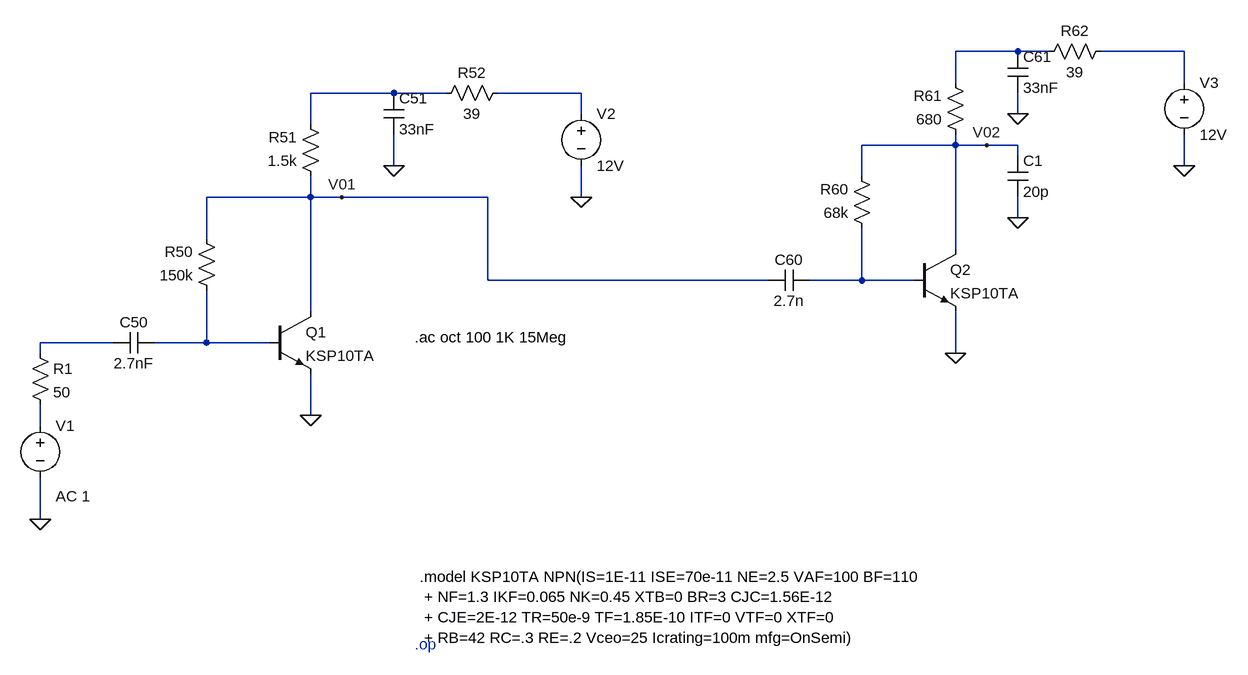
[diagram p0: schematic IF1 + IF2.asc]
IF1 + IF2.asc, the LTspice schematic file:
Version 4.1
SHEET 1 1480 680
WIRE 1152 -576 1056 -576
WIRE 1200 -576 1152 -576
WIRE 1408 -576 1280 -576
WIRE 1056 -528 1056 -576
WIRE 1408 -528 1408 -576
WIRE 192 -512 64 -512
WIRE 272 -512 192 -512
WIRE 480 -512 352 -512
WIRE 480 -480 480 -512
WIRE 1152 -480 1152 -512
WIRE 64 -464 64 -512
WIRE 1056 -432 1056 -448
WIRE 1056 -432 912 -432
WIRE 1104 -432 1056 -432
WIRE 1152 -432 1104 -432
WIRE 1152 -416 1152 -432
WIRE 192 -400 192 -448
WIRE 1408 -400 1408 -448
WIRE 912 -384 912 -432
WIRE 64 -352 64 -384
WIRE 64 -352 -96 -352
WIRE 112 -352 64 -352
WIRE 336 -352 112 -352
WIRE 480 -352 480 -400
WIRE 1152 -320 1152 -352
WIRE -96 -288 -96 -352
WIRE 1056 -272 1056 -432
WIRE 336 -224 336 -352
WIRE 768 -224 336 -224
WIRE 912 -224 912 -304
WIRE 912 -224 832 -224
WIRE 992 -224 912 -224
WIRE 64 -176 64 -352
WIRE -240 -128 -352 -128
WIRE -96 -128 -96 -208
WIRE -96 -128 -176 -128
WIRE 0 -128 -96 -128
WIRE -352 -112 -352 -128
WIRE 1056 -112 1056 -176
WIRE 64 -16 64 -80
WIRE -352 0 -352 -32
WIRE -352 144 -352 80
FLAG -352 144 0
FLAG 64 -16 0
FLAG 192 -400 0
FLAG 480 -352 0
FLAG 1056 -112 0
FLAG 1152 -480 0
FLAG 1408 -400 0
FLAG 112 -352 V01
FLAG 1152 -320 0
FLAG 1104 -432 V02
SYMBOL cap -176 -144 R90
WINDOW 0 0 32 VBottom 2
WINDOW 3 32 32 VTop 2
SYMATTR InstName C50
SYMATTR Value 2.7nF
SYMBOL res -80 -192 R180
WINDOW 0 36 76 Left 2
WINDOW 3 36 40 Left 2
SYMATTR InstName R50
SYMATTR Value 150k
SYMBOL npn 0 -176 R0
SYMATTR InstName Q1
SYMATTR Value KSP10TA
SYMBOL res 80 -368 R180
WINDOW 0 36 76 Left 2
WINDOW 3 36 40 Left 2
SYMATTR InstName R51
SYMATTR Value 1.5k
SYMBOL cap 176 -512 R0
SYMATTR InstName C51
SYMATTR Value 33nF
SYMBOL res 256 -496 R270
WINDOW 0 32 56 VTop 2
WINDOW 3 0 56 VBottom 2
SYMATTR InstName R52
SYMATTR Value 39
SYMBOL voltage 480 -496 R0
SYMATTR InstName V2
SYMATTR Value 12V
SYMBOL cap 832 -240 R90
WINDOW 0 0 32 VBottom 2
WINDOW 3 32 32 VTop 2
SYMATTR InstName C60
SYMATTR Value 2.7n
SYMBOL npn 992 -272 R0
SYMATTR InstName Q2
SYMATTR Value KSP10TA
SYMBOL res 928 -288 R180
WINDOW 0 36 76 Left 2
WINDOW 3 36 40 Left 2
SYMATTR InstName R60
SYMATTR Value 68k
SYMBOL res 1072 -432 R180
WINDOW 0 36 76 Left 2
WINDOW 3 36 40 Left 2
SYMATTR InstName R61
SYMATTR Value 680
SYMBOL res 1184 -560 R270
WINDOW 0 32 56 VTop 2
WINDOW 3 0 56 VBottom 2
SYMATTR InstName R62
SYMATTR Value 39
SYMBOL cap 1136 -576 R0
SYMATTR InstName C61
SYMATTR Value 33nF
SYMBOL voltage 1408 -544 R0
SYMATTR InstName V3
SYMATTR Value 12V
SYMBOL voltage -352 -16 R0
WINDOW 123 24 124 Left 2
WINDOW 39 0 0 Left 0
SYMATTR InstName V1
SYMATTR Value ""
SYMATTR Value2 AC 1
SYMBOL res -368 -128 R0
SYMATTR InstName R1
SYMATTR Value 50
SYMBOL cap 1136 -416 R0
SYMATTR InstName C1
SYMATTR Value 20p
TEXT 232 232 Left 2 !.model KSP10TA NPN(IS=1E-11 ISE=70e-11 NE=2.5 VAF=100 BF=110\n + NF=1.3 IKF=0.065 NK=0.45 XTB=0 BR=3 CJC=1.56E-12\n + CJE=2E-12 TR=50e-9 TF=1.85E-10 ITF=0 VTF=0 XTF=0\n + RB=42 RC=.3 RE=.2 Vceo=25 Icrating=100m mfg=OnSemi)
TEXT 224 336 Left 2 ;.op
TEXT 224 -136 Left 2 !.ac oct 100 1K 15Meg

The netlist it stands for:
* IF1 + IF2.asc
C50 N007 N006 2.7nF
R50 N007 V01 150k
Q1 V01 N007 0 0 KSP10TA
R51 V01 N003 1.5k
C51 N003 0 33nF
R52 N003 N004 39
V2 N004 0 12V
C60 N005 V01 2.7n
Q2 V02 N005 0 0 KSP10TA
R60 N005 V02 68k
R61 V02 N001 680
R62 N001 N002 39
C61 N001 0 33nF
V3 N002 0 12V
V1 N008 0 AC 1
R1 N006 N008 50
C1 V02 0 20p
.model NPN NPN
.model PNP PNP
.lib standard.bjt
.model KSP10TA NPN(IS=1E-11 ISE=70e-11 NE=2.5 VAF=100 BF=110
 + NF=1.3 IKF=0.065 NK=0.45 XTB=0 BR=3 CJC=1.56E-12
 + CJE=2E-12 TR=50e-9 TF=1.85E-10 ITF=0 VTF=0 XTF=0
 + RB=42 RC=.3 RE=.2 Vceo=25 Icrating=100m mfg=OnSemi)
* .op
.ac oct 100 1K 15Meg
.backanno
.end